# EAGLE design ReSpeaker Grove Extension Board v1.0 (EAGLE 7.3.0)
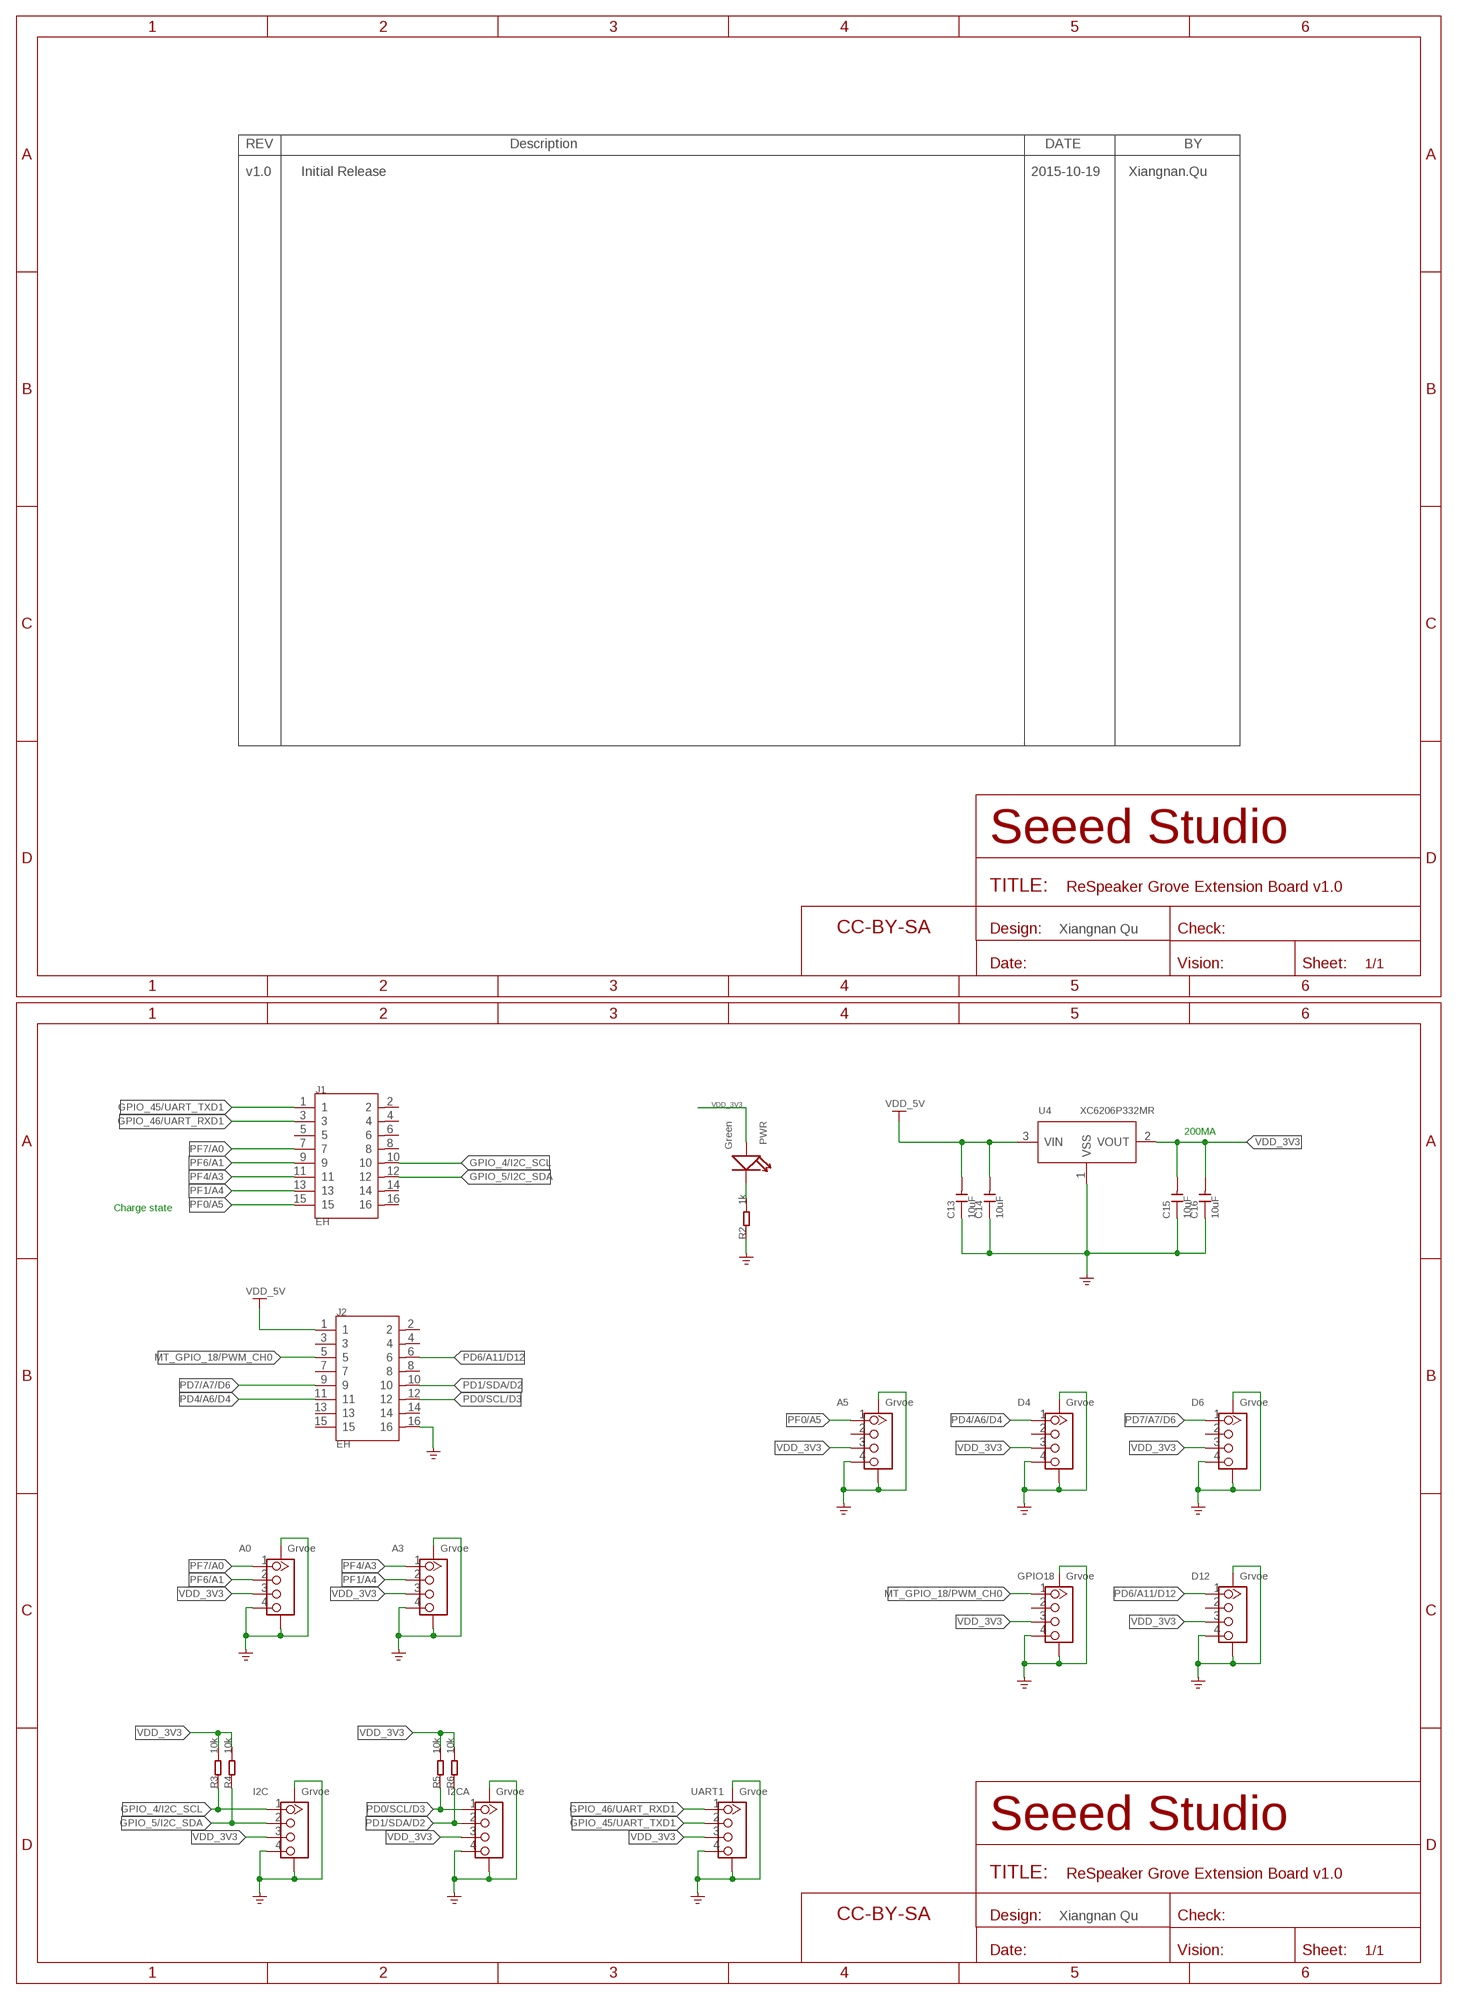
[diagram p0: schematic, sheet 1]

## Parts
A0  Grvoe  GROVE-CONNECTOR-SMD'90D'  [HW4-SMD-2.0-90D]
A3  Grvoe  GROVE-CONNECTOR-SMD'90D'  [HW4-SMD-2.0-90D]
A5  Grvoe  GROVE-CONNECTOR-SMD'90D'  [HW4-SMD-2.0-90D]
C13  10uF  CAP-0603  [C0603]
C14  10uF  CAP-0603  [C0603]
C15  10uF  CAP-0603  [C0603]
C16  10uF  CAP-0603  [C0603]
D4  Grvoe  GROVE-CONNECTOR-SMD'90D'  [HW4-SMD-2.0-90D]
D6  Grvoe  GROVE-CONNECTOR-SMD'90D'  [HW4-SMD-2.0-90D]
D12  Grvoe  GROVE-CONNECTOR-SMD'90D'  [HW4-SMD-2.0-90D]
FR1  SEEEDSTUDIO-OPEN-SCH-FRAME  [SEEEDSTUDIO-PCB-FRAME]
FR2  SEEEDSTUDIO-OPEN-SCH-FRAME  [SEEEDSTUDIO-PCB-FRAME]
GPIO18  Grvoe  GROVE-CONNECTOR-SMD'90D'  [HW4-SMD-2.0-90D]
I2C  Grvoe  GROVE-CONNECTOR-SMD'90D'  [HW4-SMD-2.0-90D]
I2CA  Grvoe  GROVE-CONNECTOR-SMD'90D'  [HW4-SMD-2.0-90D]
J1  EH  HEADER-2X8P2.0  [H2X8-2.0]
J2  EH  HEADER-2X8P2.0  [H2X8-2.0]
PWR  Green  LED-0402  [LED-0402]
R2  1k  RES-0402  [R0402]
R3  10k  RES-0402  [R0402]
R4  10k  RES-0402  [R0402]
R5  10k  RES-0402  [R0402]
R6  10k  RES-0402  [R0402]
U4  XC6206P332MR  PMIC-XC6206PMR  [SOT-23]
UART1  Grvoe  GROVE-CONNECTOR-SMD'90D'  [HW4-SMD-2.0-90D]

## Nets
GND: A0.4 A0.SS1 A0.SS2 A3.4 A3.SS1 A3.SS2 A5.4 A5.SS1 A5.SS2 C13.1 C14.1 C15.1 C16.1 D4.4 D4.SS1 D4.SS2 D6.4 D6.SS1 D6.SS2 D12.4 D12.SS1 D12.SS2 GPIO18.4 GPIO18.SS1 GPIO18.SS2 I2C.4 I2C.SS1 I2C.SS2 I2CA.4 I2CA.SS1 I2CA.SS2 J2.16 R2.1 U4.1(VSS) UART1.4 UART1.SS1 UART1.SS2 ; supply symbol labelled GND_POWER
GPIO_4/I2C_SCL: I2C.1 J1.10 R3.1
GPIO_5/I2C_SDA: I2C.2 J1.12 R4.1
GPIO_45/UART_TXD1: J1.1 UART1.2
GPIO_46/UART_RXD1: J1.3 UART1.1
MT_GPIO_18/PWM_CH0: GPIO18.1 J2.5
N$3: PWR.- R2.2
PD0/SCL/D3: I2CA.1 J2.12 R5.1
PD1/SDA/D2: I2CA.2 J2.10 R6.1
PD4/A6/D4: D4.1 J2.11
PD6/A11/D12: D12.1 J2.6
PD7/A7/D6: D6.1 J2.9
PF0/A5: A5.1 J1.15
PF1/A4: A3.2 J1.13
PF4/A3: A3.1 J1.11
PF6/A1: A0.2 J1.9
PF7/A0: A0.1 J1.7
VDD_3V3: A0.3 A3.3 A5.3 C15.2 C16.2 D4.3 D6.3 D12.3 GPIO18.3 I2C.3 I2CA.3 PWR.+ R3.2 R4.2 R5.2 R6.2 U4.2(VOUT) UART1.3
VDD_5V: C13.2 C14.2 J2.1 U4.3(VIN) ; supply symbol labelled POWER_BAR
Unconnected: A5.2 D4.2 D6.2 D12.2 GPIO18.2 J1.2 J1.4 J1.5 J1.6 J1.8 J1.14 J1.16 J2.2 J2.3 J2.4 J2.7 J2.8 J2.13 J2.14 J2.15

## Notes on the sheet
- v1.0 | Initial Release | 2015-10-19 | Xiangnan.Qu
- Xiangnan Qu
- 200MA
- Charge state
- Xiangnan Qu

## Library data of the parts
A0 A3 A5 D4 D6 D12 GPIO18 I2C I2CA UART1 = Connector-new:GROVE-CONNECTOR-SMD: 4P-SMD-2.0:320110030;4P-SMD-2.0-90D:320110032
C13-C16 = Discrete-new:CAP: Ceramic Capacitors
FR1 FR2 = moudle-new:SEEEDSTUDIO-OPEN-SCH-FRAME
J1 J2 = Connector-new:HEADER-2X8P
PWR = Discrete-new:LED
R2-R6 = Discrete-new:RES
U4 = IC-new:PMIC-XC6206P: LOW ESR Cap.Compatible Positive Voltage Regulators

## Net classes
0 default: width 0.025 mm, drill 0.203 mm, clearance 0.102 mm

## Board
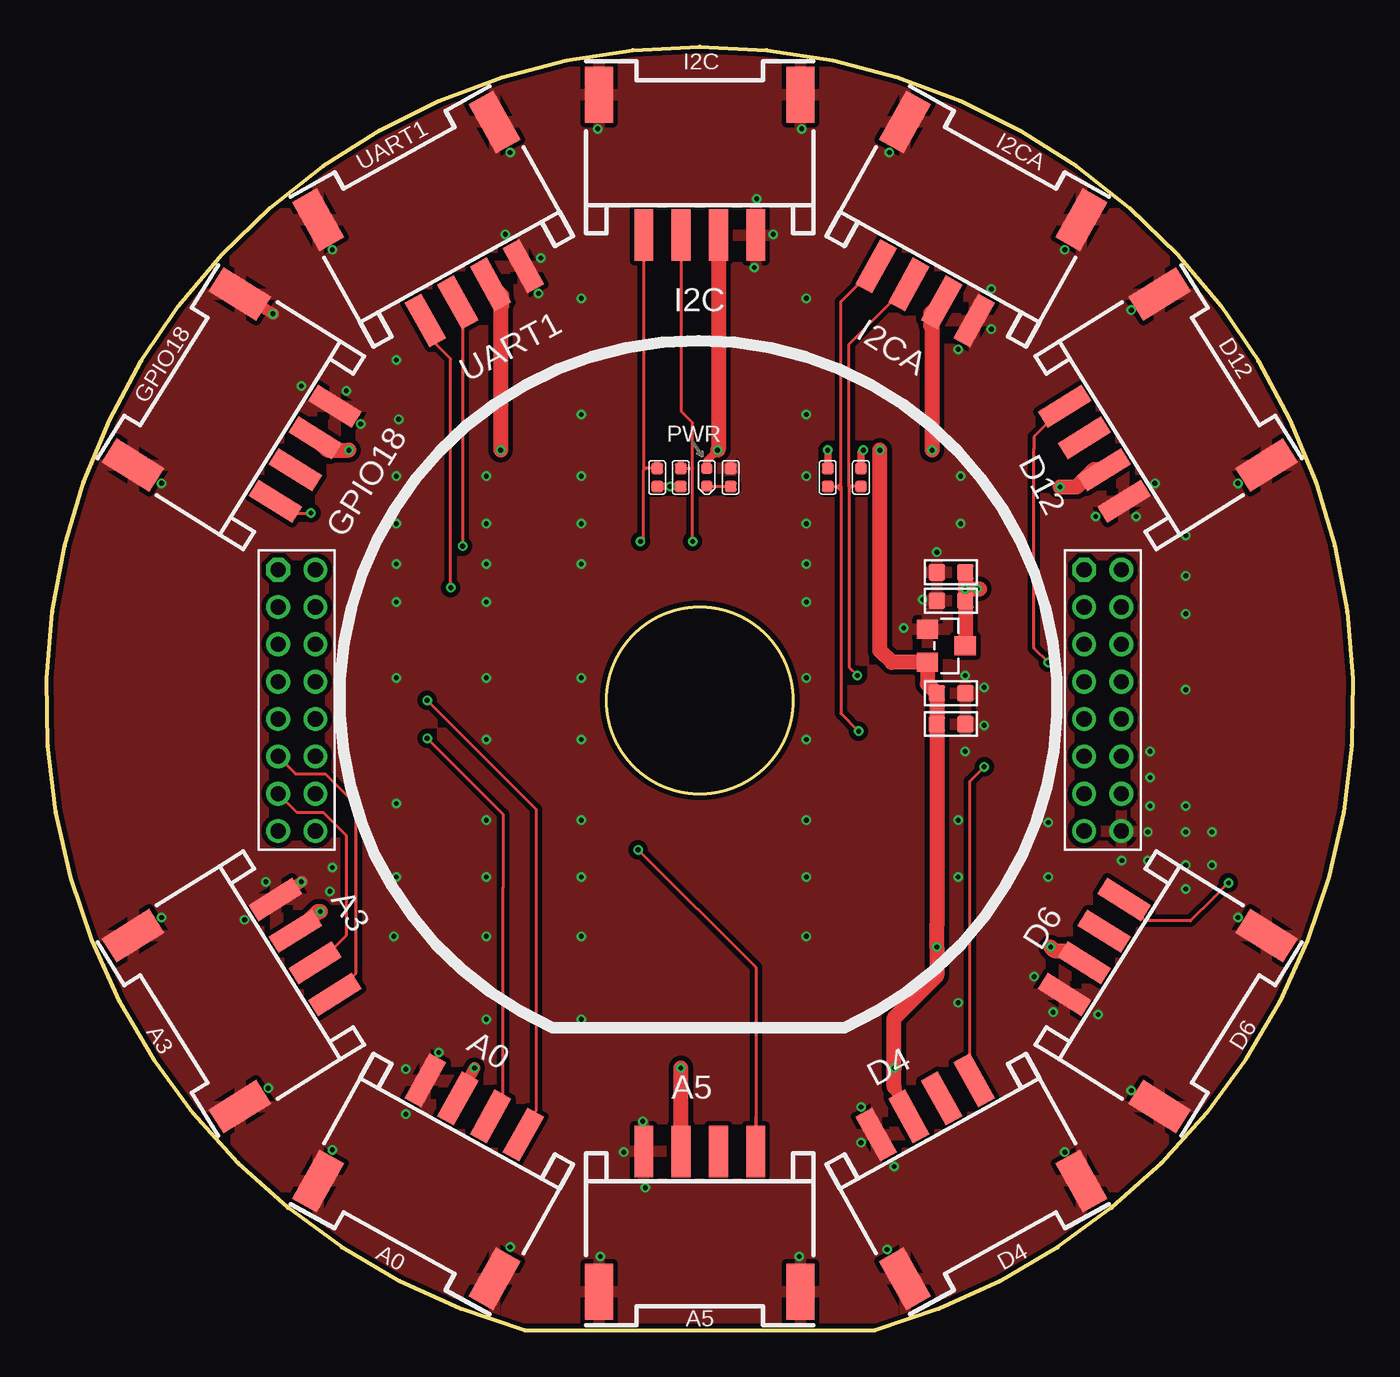
[diagram p1: board, top side]
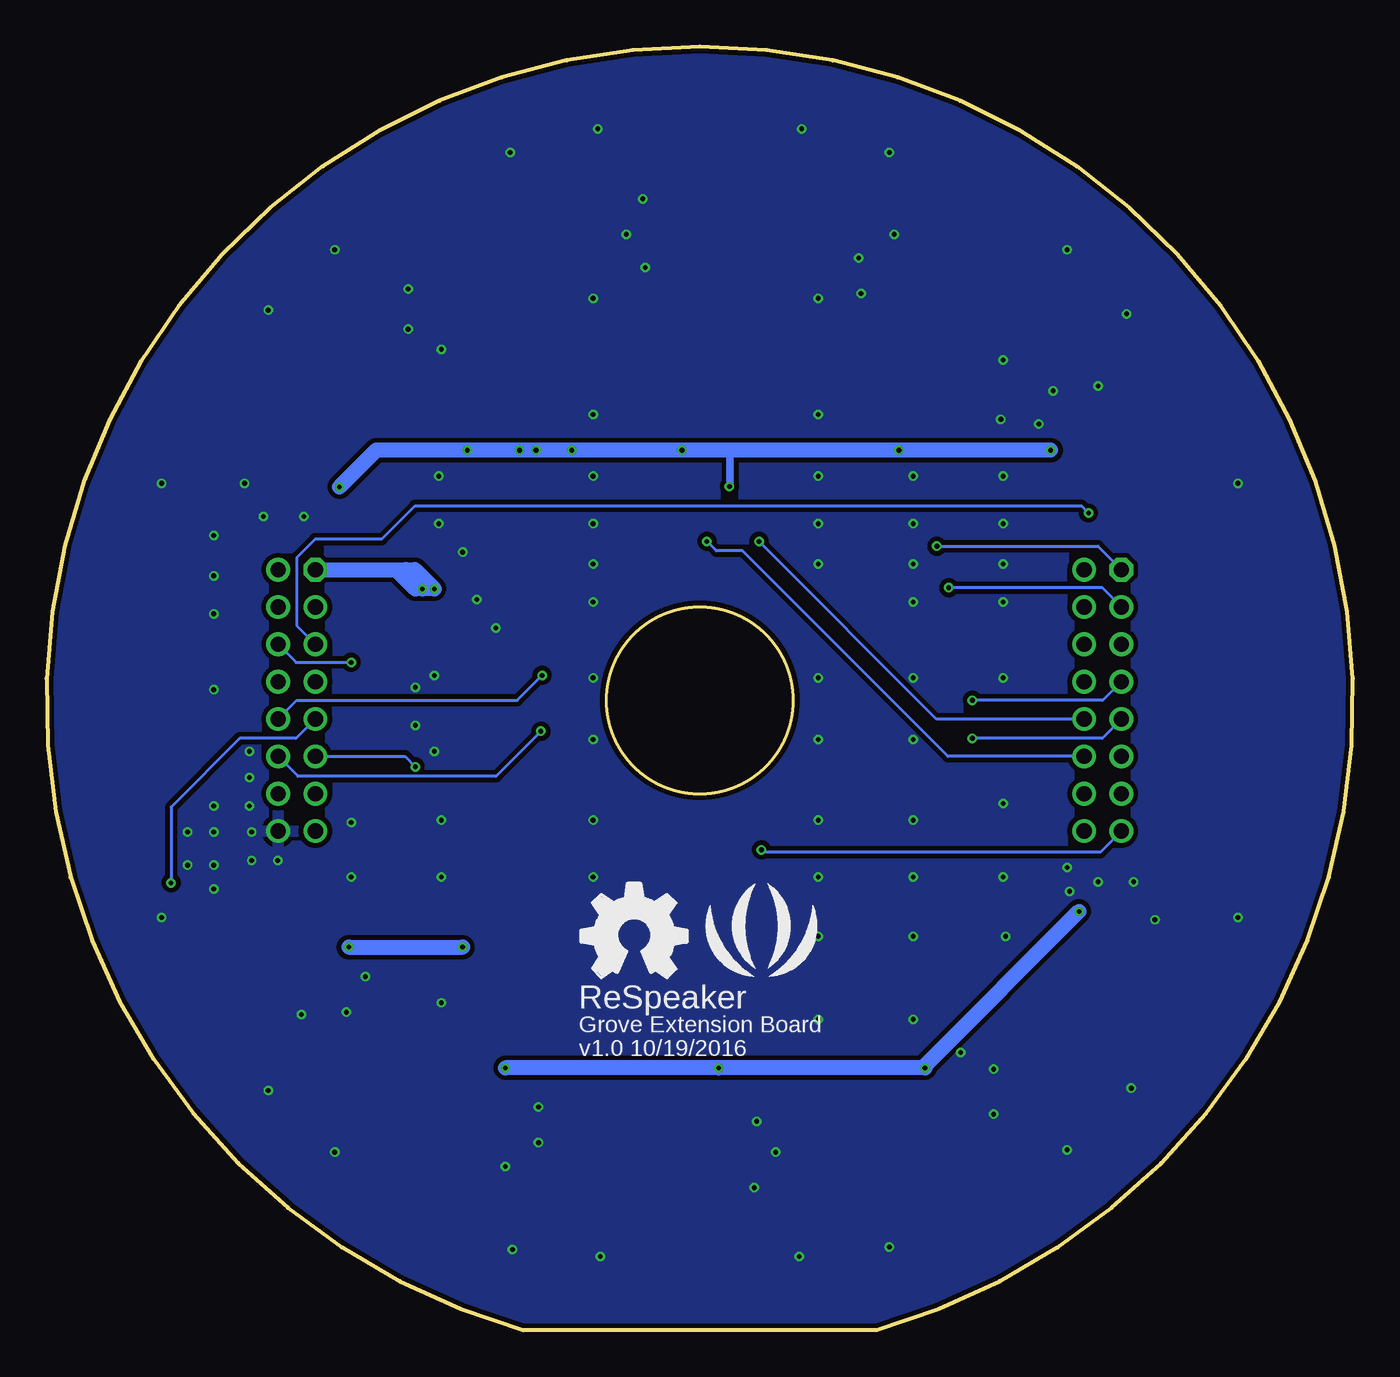
[diagram p2: board, bottom side, seen from below]

Size 69.97 x 68.72 mm. Coordinates in mm from the lower left corner, seen from the top.
Outline: 25.59,0 44.38,0 arc329 25.59,0
Outline: circle at 34.98,33.72 radius 5
Copper layers (1*16): Top 0.035mm / dielectric 1.5mm / Bottom 0.035mm
Design rules "SeeedStudio_4layer_DRU_no_angle_20140221 *": minimum track width 1mil, minimum drill 10mil, track to track 6mil, track to pad 6mil, pad to pad 6mil, via to via 6mil, smd to smd 0mil, copper to edge 10mil, drill to drill 8mil, minimum pad ring 6mil, minimum via ring 4mil, stop-mask expansion 4mil, vias tented up to drill 25mil, thermal gap 10mil

### Footprints (pad centres in the part's own frame; a part is rotated, then mirrored left to right if it is on the bottom)
HW4-SMD-2.0-90D = smd 1.01 x 2.74: 1 -3,-0.1; 2 -1,-0.1; 3 1,-0.1; 4 3,-0.1 | smd 1.5 x 3: SS1 -5.4,7.4; SS2 5.4,7.4
C0603 = smd 0.889 x 0.889: 1 0,0.762; 2 0,-0.762
H2X8-2.0 = drill 0.813 pad 1.27 octagon: 1 -1,7 | drill 0.813 pad 1.27: 2 1,7; 3 -1,5; 4 1,5; 5 -1,3; 6 1,3; 7 -1,1; 8 1,1; 9 -1,-1; 10 1,-1; 11 -1,-3; 12 1,-3; 13 -1,-5; 14 1,-5; 15 -1,-7; 16 1,-7
LED-0402 = smd 0.58 x 0.58: + -0.468,0; - 0.468,0
R0402 = smd 0.635 x 0.635: 1 0,0.484; 2 0,-0.484
SOT-23 = smd 1.016 x 1.143: 1 -0.889,-1.016; 2 0.889,-1.016; 3 0,1.016

### Placement (x,y rotation side)
A0  22.85,11.84 151 top
A3  13.77,20.46 122 top
A5  34.98,9.46 180 top
C13  48.45,40.58 90 top
C14  48.45,39.05 90 top
C15  48.45,34.1 270 top
C16  48.45,32.45 270 top
D4  47.11,11.84 209 top
D6  56.2,20.46 238 top
D12  56.2,46.98 302 top
FR1  -27.63,-55.69 0 top  (outside the outline)
FR2  -27.88,-40.45 0 top  (outside the outline)
GPIO18  13.77,46.98 58 top
I2C  34.98,58.74 0 top
I2CA  47.11,55.6 331 top
J1  13.39,33.72 0 top
J2  56.57,33.72 0 top
PWR  35.37,45.66 270 top
R2  36.64,45.66 0 top
R3  32.7,45.66 0 top
R4  33.97,45.66 0 top
R5  41.84,45.66 180 top
R6  43.62,45.66 180 top
U4  48.19,36.64 270 top
U$75  [OSHW_FILLX200_NOTEXT_TNAME]  41.33,18.86 0 bottom
U$76  [SEEED-SILK-TNAME-280*268MIL]  31.68,20.64 0 bottom
UART1  22.85,55.6 29 top

### Tracks (layer width: path | path; a pad name or v marks a point on that pad's centre or on a via)
GND  (via drill 0.25 pad 0.51)
  Top 0.61: GPIO18.SS2 v12.12,54.42 | A3.4 v13.65,24
  other vias: 15.3,57.85 24.82,63.06 29.52,64.33 40.45,64.33 45.14,63.06 54.54,57.85 48.83,52.51 58.1,54.61 63.81,45.34 56.19,43.56 63.81,22.1 58.1,12.83 54.54,9.52 45.02,4.32 40.32,3.94 29.65,3.94 24.82,4.45 15.3,9.65 11.87,12.95 6.16,22.1 21.01,14.86 31.94,11.18 43.62,11.94 6.16,45.34 16.82,48.51 26.35,55.5 37.91,56.9 58.35,43.56 59.37,45.34 50.61,53.59 50.61,55.75 38.92,58.67 38.03,60.58 26.48,57.4 24.57,58.67 16.06,50.29 13.65,50.55 11.74,24 10.6,21.97 15.3,24.77 15.17,23.49 19.24,13.97 19.24,11.56 32.06,7.62 30.92,9.52 43.62,10.03 45.4,8.76 53.91,17.02 56.32,16.89 52.89,18.92 58.99,26.67 57.59,25.15 58.99,25.15 18.6,21.08 18.73,24.26 18.73,28.19 18.73,34.92 18.73,38.99 18.73,41.02 18.73,43.18 18.73,45.72 18.86,48.77 18.73,51.94 23.55,16.64 23.55,21.08 23.55,24.26 23.55,27.3 23.55,31.62 23.55,34.92 23.55,38.99 23.55,41.02 23.55,43.18 23.55,45.72 28.63,16.64 28.63,21.08 28.63,24.26 28.63,27.3 28.63,31.62 28.63,34.92 28.63,41.02 28.63,43.18 28.63,45.72 40.7,21.08 40.7,24.26 40.7,27.3 40.7,31.62 40.7,34.92 40.7,38.99 40.7,41.02 40.7,43.18 40.7,45.72 48.83,17.53 48.83,24.26 48.83,27.3 48.95,43.18 48.95,45.72 49.21,30.99 50.22,32.38 50.22,34.42 49.21,35.05 45.91,37.59 46.92,39.12 47.68,41.66 28.63,49.02 28.63,55.24 40.7,55.24 40.7,49.02 61.02,23.62 61.02,26.67 61.02,28.07 61.02,34.29 61.02,38.35 61.02,40.39 61.02,42.55 53.65,27.18 53.65,24.26 59.11,28.07 59.11,29.59 59.11,30.99 62.42,26.67 62.42,24.89 61.02,24.89
  pour Top (isolate 0.254): -0.58,69.28 70.54,69.28 70.54,33.08 70.54,-0.57 24.82,-0.57 -0.58,-0.57
  pour Bottom (isolate 0.254): -0.58,69.28 70.54,69.28 70.54,33.08 70.54,-0.57 24.82,-0.57 -0.58,-0.57
GPIO_4/I2C_SCL  (via drill 0.25 pad 0.51)
  Top 0.152: I2C.1 31.98,46.24 | 31.98,46.24 31.98,46.16 | 31.98,46.16 31.98,46.03 | R3.1 32.01,46.14 31.98,46.16 | 31.98,46.24 32.06,46.16 32.06,46.11 31.98,46.03 | v31.81,42.23 31.98,42.4 31.98,46.03
  Bottom 0.152: J1.10 22.3,32.72 v31.81,42.23
GPIO_5/I2C_SDA  (via drill 0.25 pad 0.51)
  Top 0.152: I2C.2 33.98,49.2 34.6,48.58 34.6,46.16 | v34.6,42.23 34.6,46.16 | R4.1 34.58,46.14 34.6,46.16
  Bottom 0.152: J1.12 21.7,30.72 32.7,41.72 34.1,41.72 v34.6,42.23
GPIO_45/UART_TXD1  (via drill 0.25 pad 0.51)
  Top 0.152: UART1.2 22.03,54.42 22.28,54.17 v22.28,41.97
  Bottom 0.152: v22.28,41.97 13.65,41.97 J1.1
GPIO_46/UART_RXD1  (via drill 0.25 pad 0.51)
  Top 0.152: UART1.1 20.28,53.38 21.65,52.01 v21.65,39.75
  Bottom 0.152: J1.3 13.43,39.75 v21.65,39.75
MT_GPIO_18/PWM_CH0  (via drill 0.25 pad 0.51)
  Top 0.152: GPIO18.1 12.26,44.14 12.65,43.75 v14.16,43.75
  Bottom 0.152: J2.5 56.57,37.72 56.57,41.36 55.58,42.35 52.02,42.35 50.24,44.13 14.54,44.13 v14.16,43.75
N$3
  Top 0.152: PWR.- 35.38,45.17 R2.2
PD0/SCL/D3  (via drill 0.25 pad 0.51)
  Top 0.152: 43.49,56.02 I2CA.1 42.54,55.07 42.54,45.31 | R5.1 42.54,45.17 | 42.54,45.17 42.54,45.31 | 42.54,45.17 42.54,45.02 | 42.54,45.02 42.54,33.02 v43.49,32.07 | 42.54,45.02 42.48,45.02 42.35,45.15 42.51,45.31 42.54,45.31
  Bottom 0.152: v43.49,32.07 45.91,29.65 56.51,29.65 J2.12
PD1/SDA/D2  (via drill 0.25 pad 0.51)
  Top 0.152: I2CA.2 42.99,52.79 42.99,45.28 | R6.1 42.99,45.17 | 42.99,45.17 42.99,45.28 | 42.99,45.17 42.99,45.02 | 42.99,45.02 42.99,35.5 v43.43,35.05 | 42.99,45.02 43.11,45.15 42.99,45.28
  Bottom 0.152: J2.10 56.57,33.72 44.76,33.72 v43.43,35.05
PD4/A6/D4  (via drill 0.25 pad 0.51)
  Top 0.152: D4.1 49.69,13.93 49.46,14.16 49.46,29.4 v50.22,30.16
  Bottom 0.152: J2.11 50.78,30.72 v50.22,30.16
PD6/A11/D12  (via drill 0.25 pad 0.51)
  Top 0.152: v53.65,35.75 52.89,36.51 52.89,46.8 52.89,47.18 52.89,47.83 D12.1
  Bottom 0.152: J2.6 56.61,35.75 v53.65,35.75
PD7/A7/D6  (via drill 0.25 pad 0.51)
  Top 0.152: D6.1 58.86,21.91 61.27,21.91 62.54,23.18 v63.31,23.94
  Bottom 0.152: J2.9 56.61,31.69 59.62,31.69 63.31,28 v63.31,23.94
PF0/A5  (via drill 0.25 pad 0.51)
  Top 0.152: 37.98,11.41 A5.1 37.98,19.42 v31.68,25.72
  Bottom 0.152: J1.15 13.52,25.59 31.56,25.59 v31.68,25.72
PF1/A4
  Top 0.152: A3.2 14.58,19.67 16.06,21.15 16.06,26.48 14.82,27.72 13.39,27.72 J1.13
PF4/A3
  Top 0.152: A3.1 16.57,19.1 16.57,28.13 14.92,29.78 13.33,29.78 J1.11
PF6/A1  (via drill 0.25 pad 0.51)
  Top 0.152: A0.2 24.44,12.1 24.44,23.43 24.44,23.69 24.44,27.62 v20.38,31.69
  Bottom 0.152: J1.9 13.43,31.69 v20.38,31.69
PF7/A0  (via drill 0.25 pad 0.51)
  Top 0.152: v20.38,33.72 26.22,27.88 26.22,11.75 25.53,11.05 A0.1
  Bottom 0.152: J1.7 13.39,33.72 v20.38,33.72
VDD_3V3  (via drill 0.25 pad 0.51)
  Top 0.406: 47.45,47.09 v47.43,47.12 | R3.2 v33.4,45.17 R4.2 | PWR.+ 35.37,46.55 v35.94,47.12 | R5.2 v41.84,47.12 | R6.2 43.62,46.99 v43.75,47.12
  Top 0.61: A3.3 13.48,21.36 | 33.97,9.58 A5.3 | A0.3 v22.92,14.03 | D4.3 45.4,13.02
  Top 0.813: 45.4,16.7 47.68,18.99 v47.68,20.51 47.68,21.65 C16.2 C15.2 47.18,34.61 U4.2 45.27,35.75 44.64,36.39 v44.64,47.12 | 45.4,16.7 | 45.4,13.02 v45.4,14.03 45.4,16.7 | 33.97,9.58 v33.97,14.03 | 13.48,21.36 14.54,22.42 v14.66,22.42 | v53.78,20.51 53.97,20.32 54.73,20.32 55.39,19.67 D6.3 | GPIO18.3 15.04,47.12 v16.19,47.12 | v54.29,45.15 55.18,45.15 56.1,46.08 D12.3 | UART1.3 24.38,55.4 24.38,54.86 24.32,54.8 v24.32,47.12 | I2CA.3 47.37,54.46 47.37,53.78 47.43,53.72 v47.43,47.12 | I2C.3 35.98,47.16 v35.94,47.12
  Bottom 0.406: 33.36,47.12 33.36,45.21 v33.4,45.17
  Bottom 0.813: v45.4,14.03 v33.97,14.03 v22.92,14.03 22.92,14.16 v14.66,22.42 | v16.19,47.12 v24.32,47.12 33.36,47.12 v35.94,47.12 v41.84,47.12 v43.75,47.12 v44.64,47.12 v47.43,47.12 52.32,47.12 v54.29,45.15 | v53.78,20.51 v47.68,20.51
VDD_5V  (via drill 0.25 pad 0.51)
  Top 0.813: C13.2 v49.21,39.69 | U4.3 C14.2 v49.21,39.69 | v49.21,39.69 49.97,39.69
  Bottom 0.813: J2.1 50.73,40.72 | 50.73,40.72 50.24,40.72 v49.21,39.69 50.22,39.69 51.24,40.7 | v49.84,39.69 49.84,39.83 50.73,40.72

### Text on the board
tNames: I2C | I2CA | UART1 | D12 | GPIO18 | A3 | D6 | A0 | A5 | D4
bNames: ReSpeaker | Grove Extension Board | v1.0 10/19/2016